# Altium schematic sheet Sheet1.SchDoc
size A
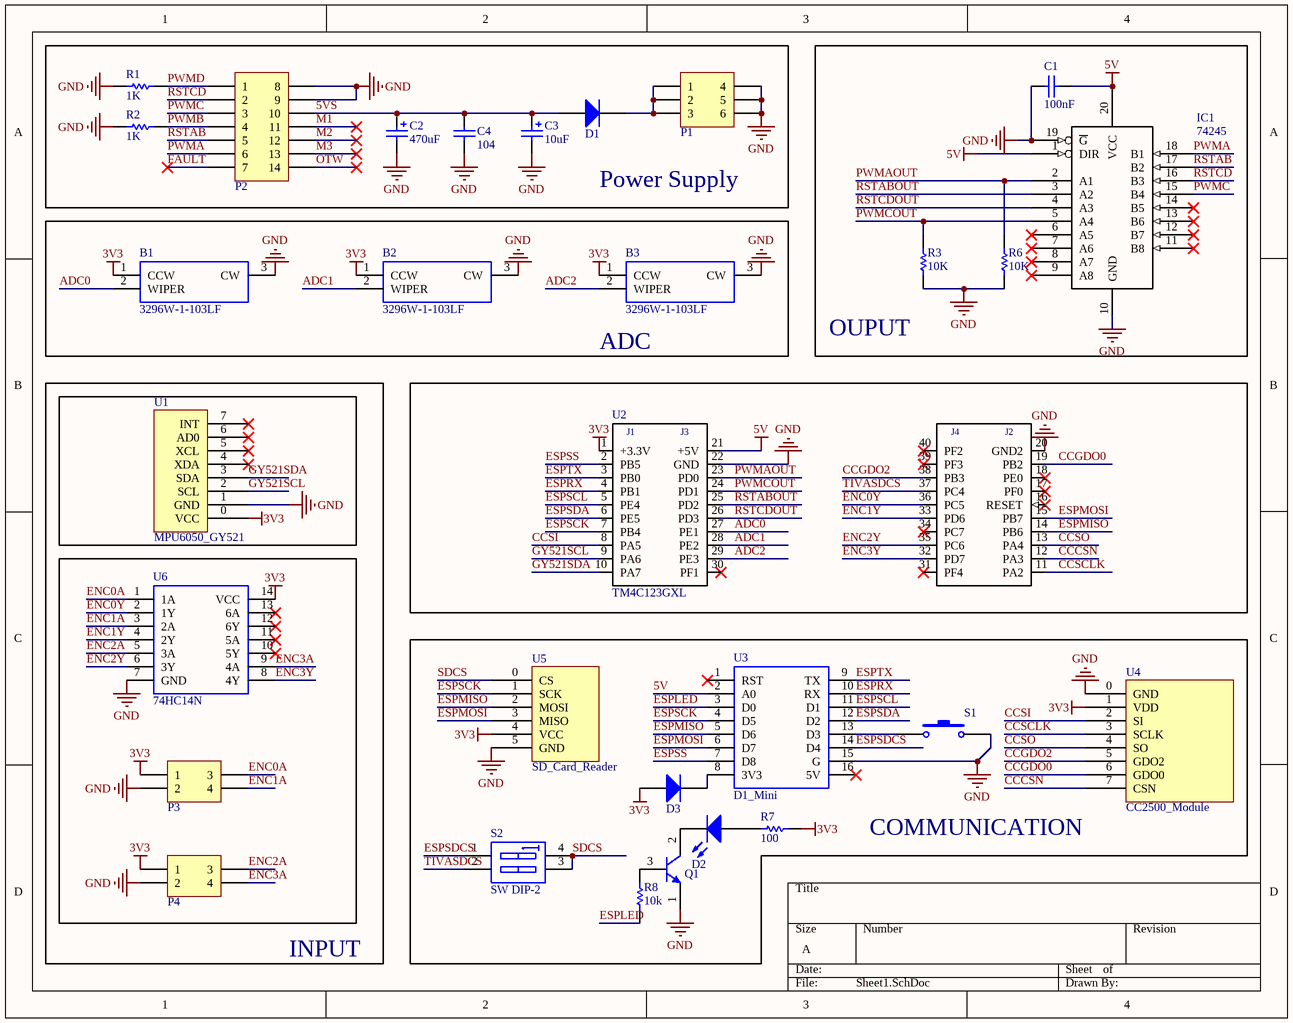
[diagram p0: Sheet1.SchDoc]

## Parts
B1  3296W-1-103LF  [Rheostat]
B2  3296W-1-103LF  [Rheostat]
B3  3296W-1-103LF  [Rheostat]
C1  value 100nF  [CN1]  (hidden comment: Cap Non-Pol)
C2  value 470uF  [CP1/2]  (hidden comment: Cap Pol)
C3  value 10uF  [CP1/2]  (hidden comment: Cap Pol)
C4  value 104  [CN1]  (hidden comment: Cap Non-Pol)
D1  Diode  [D1A]  (value not drawn)
D2  LED  [LED-3mm]  (value not drawn)
D3  Diode  [D1A]  (value not drawn)
IC1  74245  [DIP20]
P1  Header 3X2  [JP3x2]  (value not drawn)
P2  Header 7X2  [JP7X2]  (value not drawn)
P3  Header 2X2  [JP2X2]  (value not drawn)
P4  Header 2X2  [JP2X2]  (value not drawn)
Q1  C1815  [QTO-92]  (value not drawn)
R1  value 1K  [RES 1/2W]  (hidden comment: RESISTOR)
R2  value 1K  [RES 1/2W]  (hidden comment: RESISTOR)
R3  value 10K  [RES 1/2W]  (hidden comment: RESISTOR)
R6  value 10K  [RES 1/2W]  (hidden comment: RESISTOR)
R7  value 100  [RES 1/2W]  (hidden comment: RESISTOR)
R8  value 10k  [RES 1/2W]  (hidden comment: RESISTOR)
S1  Tact SW - 2Pin  [SW2]  (value not drawn)
S2  SW DIP-2  [DIPSWITCH2]
U1  MPU6050_GY521  [MPU6050_GY521]
U2  TM4C123GXL  [EK-TM4C123GXL]
U3  D1_Mini  [D1_Mini]
U4  CC2500_Module  [CC2500_module]
U5  SD_Card_Reader  [SD_Card_Reader]
U6  74HC14N  [74HC14N]

## Blocks framed on the sheet
Power Supply: C2-C4 D1 P1 P2 R1 R2
OUPUT: C1 IC1 R3 R6
ADC: B1-B3
INPUT: P3 P4 U1 U6
COMMUNICATION: D2 D3 Q1 R7 R8 S1 S2 U3-U5

## Nets
3V3: B1.1(CCW) B2.1(CCW) B3.1(CCW) D3.1(A) P3.1 P4.1 R7.2 U1.0(VCC) U2.1(+3.3V) U4.1(VDD) U5.4(VCC) U6.14(VCC)
5V: C1.2 IC1.1(DIR) IC1.20(VCC) U2.21(+5V) U3.2(A0)
GND: B1.3(CW) B2.3(CW) B3.3(CW) C1.1 C2.2 C3.2 C4.2 IC1.10(GND) IC1.19(~{G}) P1.4 P1.5 P1.6 P2.8 P2.9 P3.2 P4.2 Q1.1(E) R1.1 R2.1 R3.1 R6.1 S1.2 U1.1(GND) U2.20(GND2) U2.22(GND) U3.15(G) U4.0(GND) U5.5(GND) U6.7(GND)
5VS: C2.1 C3.1 C4.1 D1.1(A) P2.10
ADC0: B1.2(WIPER) U2.27(PE1)
ADC1: B2.2(WIPER) U2.28(PE2)
ADC2: B3.2(WIPER) U2.29(PE3)
CCCSN: U2.12(PA3) U4.7(CSN)
CCGDO0: U2.19(PB2) U4.6(GDO0)
CCGDO2: U2.38(PB3) U4.5(GDO2)
CCSCLK: U2.11(PA2) U4.3(SCLK)
CCSI: U2.8(PA5) U4.2(SI)
CCSO: U2.13(PA4) U4.4(SO)
ENC0A: P3.3 U6.1(1A)
ENC0Y: U2.36(PC5) U6.2(1Y)
ENC1A: P3.4 U6.3(2A)
ENC1Y: U2.33(PD6) U6.4(2Y)
ENC2A: P4.3 U6.5(3A)
ENC2Y: U2.35(PC6) U6.6(3Y)
ENC3A: P4.4 U6.9(4A)
ENC3Y: U2.32(PD7) U6.8(4Y)
ESPLED: R8.1 U3.3(D0)
ESPMISO: U2.14(PB6) U3.5(D6) U5.2(MOSI)
ESPMOSI: U2.15(PB7) U3.6(D7) U5.3(MISO)
ESPRX: U2.4(PB1) U3.10(RX)
ESPSCK: U2.7(PB4) U3.4(D5) U5.1(SCK)
ESPSCL: U2.5(PE4) U3.11(D1)
ESPSDA: U2.6(PE5) U3.12(D2)
ESPSDCS: S2.1(A1) U3.14(D4)
ESPSS: U2.2(PB5) U3.7(D8)
ESPTX: U2.3(PB0) U3.9(TX)
FAULT: P2.7
GY521SCL: U1.2(SCL) U2.9(PA6)
GY521SDA: U1.3(SDA) U2.10(PA7)
M1: P2.11
M2: P2.12
M3: P2.13
OTW: P2.14
PWMA: IC1.18(B1) P2.6
PWMAOUT: IC1.2(A1) R6.2 U2.23(PD0)
PWMB: P2.4 R2.2
PWMC: IC1.15(B4) P2.3
PWMCOUT: IC1.5(A4) R3.2 U2.24(PD1)
PWMD: P2.1 R1.2
RSTAB: IC1.17(B2) P2.5
RSTABOUT: IC1.3(A2) U2.25(PD2)
RSTCD: IC1.16(B3) P2.2
RSTCDOUT: IC1.4(A3) U2.26(PD3)
SDCS: S2.3(B2) S2.4(B1) U5.0(CS)
TIVASDCS: S2.2(A2) U2.37(PC4)
NetD1_2: D1.2(K) P1.1 P1.2 P1.3
NetD2_1: D2.1(A) R7.1
NetD2_2: D2.2(K) Q1.2(C)
NetD3_2: D3.2(K) U3.8(3V3)
NetQ1_3: Q1.3(B) R8.2
NetS1_1: S1.1 U3.13(D3)

Not connected (* = marked no-connect by the designer): IC1 6(A5)* 7(A6)* 8(A7)* 9(A8)* 11(B8)* 12(B7)* 13(B6)* 14(B5)*; U1 4(XDA)* 5(XCL)* 6(AD0)* 7(INT)*; U2 16(RESET)* 17(PF0)* 18(PE0)* 30(PF1)* 31(PF4)* 34(PC7)* 39(PF3)* 40(PF2)*; U3 1(RST)* 16(5V)*; U6 10(5Y)* 11(5A)* 12(6Y)* 13(6A)*

## Notes on the sheet
- (in symbol EK-TM4C123GXL) J1; J3; J4; J2

## Library data of the parts
B1-B3 = Rheostat: Manufacturer_Name: Bourns; Allied_Number: 70153918; Geometry.Height: 11.55mm; Supplier_Name: RS; RS Part Number: 5219647P; Manufacturer_Part_Number: 3296W-1-103LF; Other Part Number: *; Datasheet Link: http://docs-europe.electrocomponents.com/webdocs/069c/0900766b8069ccf4.pdf; 3D Package: *
C1 C4 = Cap Non-Pol: Capacitor
C2 C3 = Cap Pol: Polarized Capacitor (Radial)
D1 D3 = Diode: Default Diode
IC1 = 74245_1: Octal bus tranceiver; 3-state; Copyright by: VanDungEvn@gmail.com
P1 = Header 3X2: Header, 3-Pin, Dual row; LatestRevisionDate: 17-Jul-2002; LatestRevisionNote: Re-released for DXP Platform.; Publisher: Altium Limited
P2 = Header 7X2: Header, 7-Pin, Dual row; LatestRevisionDate: 17-Jul-2002; LatestRevisionNote: Re-released for DXP Platform.; Publisher: Altium Limited
P3 P4 = Header 2X2: Header, 2-Pin, Dual row; LatestRevisionDate: 17-Jul-2002; LatestRevisionNote: Re-released for DXP Platform.; Publisher: Altium Limited
Q1 = C1815: NPN Bipolar Transistor
S1 = Tact SW - 2Pin: Switch button 2 pin
S2 = SW DIP-2: DIP Switch, 2 Position, SPST; Published: 24-Mar-1999; LatestRevisionDate: 17-Jul-2002; LatestRevisionNote: Re-released for DXP Platform.; PackageReference: DIP-4; Publisher: Altium Limited
U2 = EK-TM4C123GXL